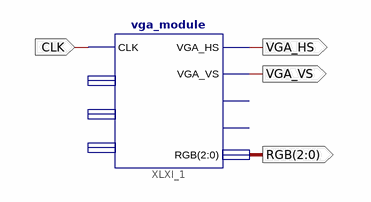
[diagram p0: schematic sheet 1]
// Xilinx ISE schematic main_scheme.sch (spartan3e) as structural Verilog: 1 symbols, 4 ports
module main_scheme (
  input  CLK,
  output VGA_HS,
  output VGA_VS,
  output [2:0] RGB
);

  vga_module XLXI_1 (
    .CLK(CLK), .VGA_HS(VGA_HS), .VGA_VS(VGA_VS), .RGB(RGB));  // open: x_cord, pilka_x, pilka_y, odbicie_x, odbicie_y
endmodule
